# EAGLE design USB2Power (EAGLE 7.3.0)
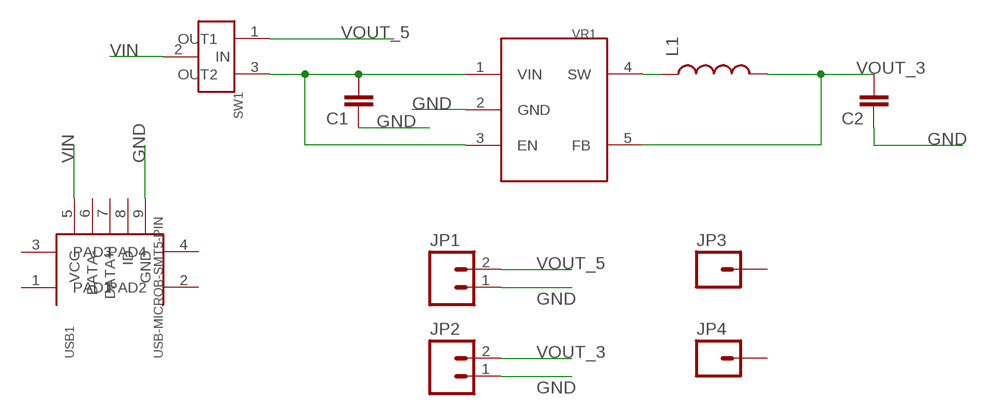
[diagram p0: schematic, sheet 1]

## Parts
C1  CAP0603-CAP  [0603-CAP]
C2  CAP0603-CAP  [0603-CAP]
JP1  M02PTH  [1X02]
JP2  M02PTH  [1X02]
JP3  M01PTH  [1X01]
JP4  M01PTH  [1X01]
L1  INDUCTOR30OHM,1.8A  [0603]
SW1  PCM12SMTR  [PCM12SMTR]
USB1  USB-MICROB-SMT5-PIN  [USB-MICROB-SMT]
VR1  ADP2108  [UJ-5_TSOT]

## Nets
GND: C1.1 C2.1 JP1.1 JP2.1 USB1.9(GND) VR1.2(GND)
N$1: C1.2 SW1.3(OUT2) VR1.1(VIN) VR1.3(EN)
N$2: L1.1 VR1.4(SW)
VIN: SW1.2(IN) USB1.5(VCC)
VOUT_3: C2.2 JP2.2 L1.2 VR1.5(FB)
VOUT_5: JP1.2 SW1.1(OUT1)
Unconnected: JP3.1 JP4.1 USB1.1(PAD1) USB1.2(PAD2) USB1.3(PAD3) USB1.4(PAD4) USB1.6(DATA-) USB1.7(DATA+) USB1.8(ID)

## Library data of the parts
C1 C2 = SparkFun-Capacitors:CAP: Capacitor Standard 0603 ceramic capacitor, and 0.1" leaded capacitor.
JP1 JP2 = SparkFun-Connectors:M02: Standard 2-pin 0.1" header. Use with - straight break away headers ( PRT-00116) - right angle break away headers (PRT-00553) - swiss pins (PRT-00743) - machine pins (PRT-00117) - female headers (PRT-00115) Molex polarized connector foot print use with: PRT-08233 with associated crimp pins and housings. 2.54_SCREWTERM for use with PRT-10571. 3.5mm Screw Terminal footprints for PRT-08084 5mm Screw Terminal footprints for use with PRT-08432
JP3 JP4 = SparkFun-Connectors:M01: Header 1 Standard 1-pin 0.1" header. Use with straight break away headers (SKU : PRT-00116), right angle break away headers (PRT-00553), swiss pins (PRT-00743), machine pins (PRT-00117), and female headers (PRT-00115).
L1 = SparkFun-Passives:INDUCTOR: Inductors Basic Inductor/Choke - 0603 and 1206. Footprints are not proven and vary greatly between part numbers. INDUCTOR POWER 3.3UH 4.0A SMD 0.197" L x 0.197" W x 0.177" H (5.00mm x 5.00mm x 4.50mm); PROD_ID: RES-07859
SW1 = freddyLibr:PCM12SMTR: Three pin switch. Horizontal gull wing surface mount.
USB1 = freddyLibr:USB-MICROB-SMT: USB micro B receptacle. 5 pin surface mount variant.
VR1 = freddyLibr:ADP2108: Voltage Regulator with fixed conversion factor. Common: 5V to 3.3V

## Board
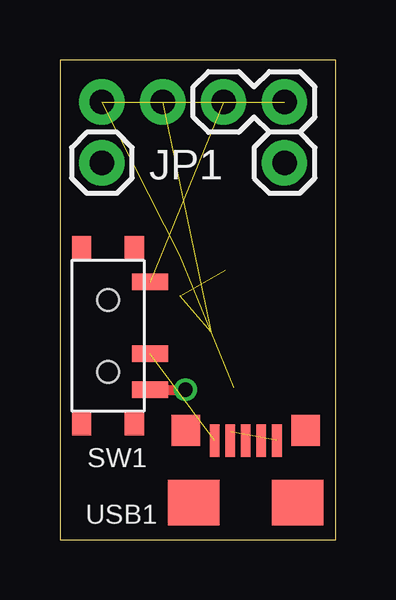
[diagram p1: board, top side]
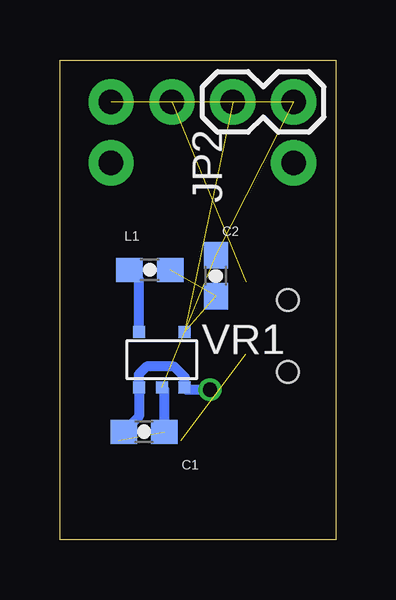
[diagram p2: board, bottom side, seen from below]

Size 11.5 x 20 mm. Coordinates in mm from the lower left corner, seen from the top.
Outline: 0,0 11.5,0 11.5,20 0,20 0,0
Copper layers (1*16): Top 0.0356mm / dielectric 1.5011mm / Bottom 0.0356mm
Design rules "oshpark-2layer": minimum track width 6mil, minimum drill 13mil, track to track 6mil, track to pad 6mil, pad to pad 6mil, via to via 6mil, smd to smd 6mil, copper to edge 15mil, drill to drill 6mil, minimum pad ring 7mil, minimum via ring 7mil, stop-mask expansion 4mil, vias tented up to drill 0mil, thermal gap 10mil

### Footprints (pad centres in the part's own frame; a part is rotated, then mirrored left to right if it is on the bottom)
0603-CAP = smd 1.1 x 1: 1 -0.85,0; 2 0.85,0
1X02 = drill 1.016 pad 1.88: 1 0,0; 2 2.54,0
1X01 = drill 1.016 pad 1.88: 1 0,0
0603 = smd 1.1 x 1: 1 -0.85,0; 2 0.85,0
PCM12SMTR = smd 0.7 x 1.5: 1 -2.25,1.75; 2 0.75,1.75; 3 2.25,1.75 | smd 1 x 0.8: 4 -3.65,1.1; 5 -3.65,-1.1; 6 3.65,1.1; 7 3.65,-1.1 | hole 0.9: -1.5,0; 1.5,0
USB-MICROB-SMT = smd 2.15 x 1.9: 1 -2.17,-0.95; 2 2.17,-0.95 | smd 1.2 x 1.3: 3 -2.5,2.05; 4 2.5,2.05 | smd 0.4 x 1.35: 5 -1.3,1.63; 6 -0.65,1.63; 7 0,1.63; 8 0.65,1.63; 9 1.3,1.63
UJ-5_TSOT = smd 0.5 x 0.5: 1 -0.95,-1.15; 2 0,-1.15; 3 0.95,-1.15; 4 -0.95,1.15; 5 0.95,1.15

### Placement (x,y rotation side)
C1  7.99,4.5 180 bottom
C2  5,11 270 bottom
JP1  9.37,18.25 180 top
JP2  1.75,18.25 180 bottom
JP3  9.37,15.71 0 top
JP4  1.75,15.71 0 top
L1  7.75,11.25 0 bottom
SW1  2,8.5 270 top
USB1  7.75,2.5 0 top
VR1  7.25,7.5 0 bottom

### Tracks (layer width: path | path; a pad name or v marks a point on that pad's centre or on a via)
GND  (4 unrouted)
  Bottom 0.406: C1.1 7.14,6.24 VR1.2
N$1  (via drill 0.6)
  Top 0.406: SW1.3 v5.24,6.25
  Bottom 0.406: v5.24,6.25 6.2,6.25 VR1.3 6.3,6.78 6.73,7.21 7.88,7.21 8.21,6.88 VR1.1 8.2,5.14 C1.2
N$2
  Bottom 0.406: VR1.4 8.2,10.85 L1.1
VIN  (1 unrouted)
VOUT_3  (3 unrouted)
VOUT_5  (1 unrouted)

### Text on the board
tOrigins: F. Lee / 8/24/15 / USB2Power / Rev. 1